# Altium project CustomPCB-test1.PrjPcb
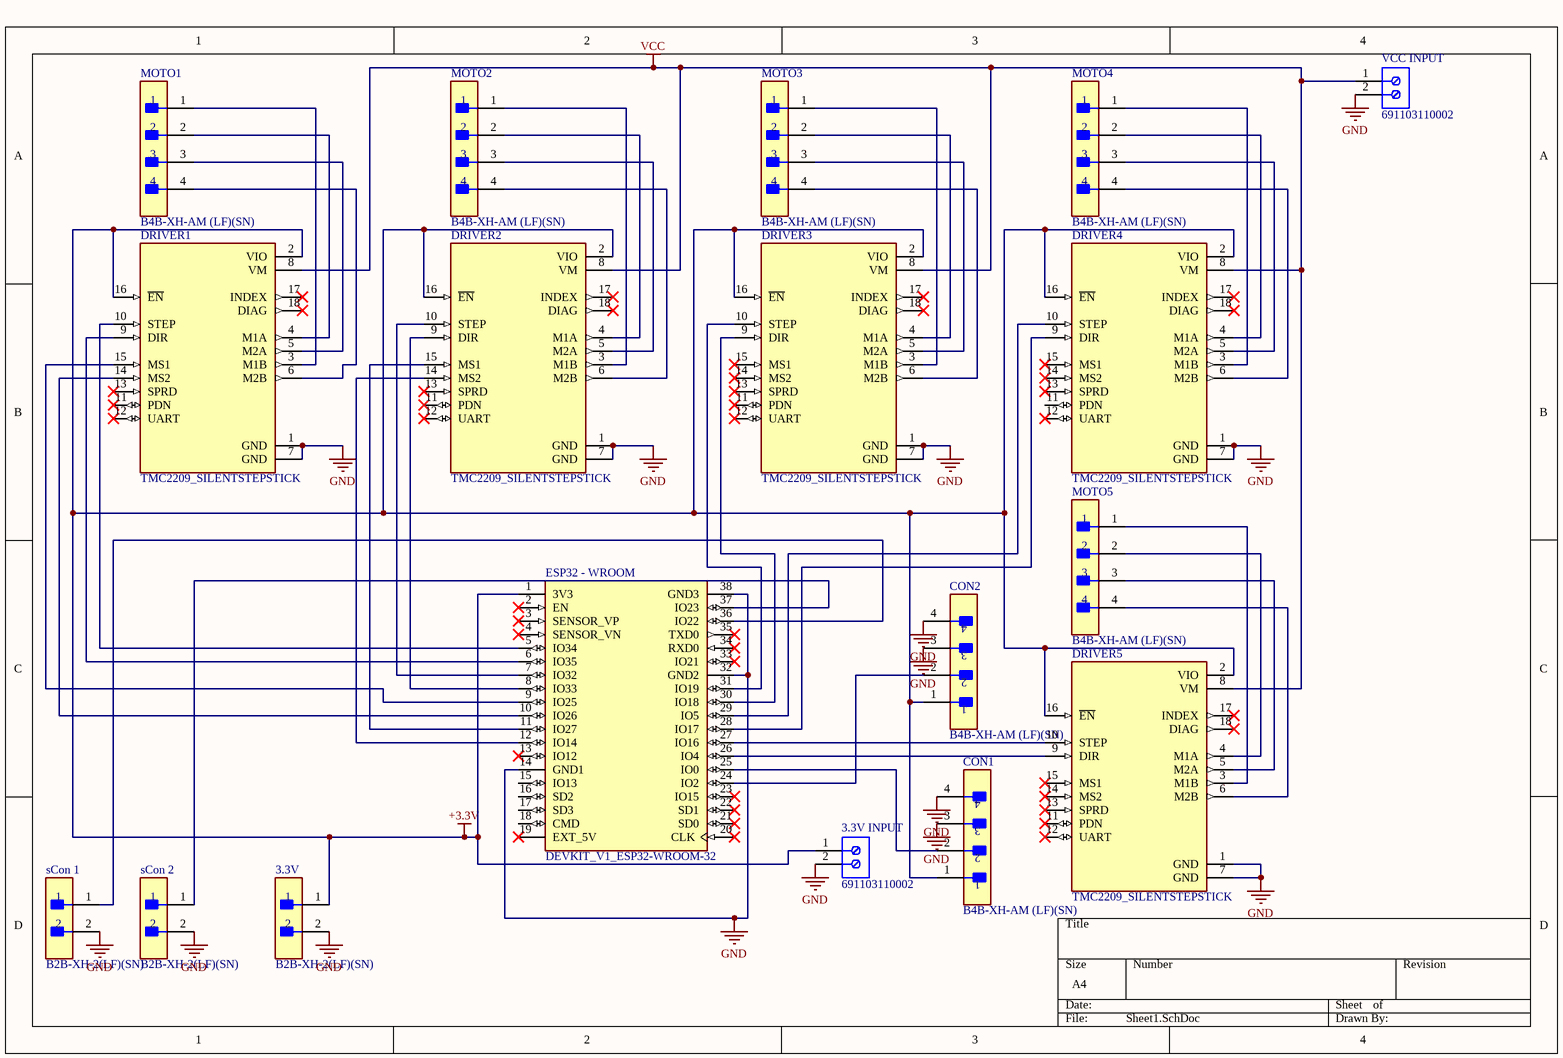
[diagram p0: Sheet1.SchDoc]
1 sheet, 18 parts. Net scope: global (net labels, ports and power ports of the same name join across sheets).
Board file: ESP32_DRIVER_BOARD.PcbDoc

## Sheet Sheet1.SchDoc
size A4; SheetNumber: 1; SheetTotal: 1

### Parts
3.3V  B2B-XH-2(LF)(SN)  [FP-B2B-XH-2_LF_SN-MFG]
3.3V_INPUT  691103110002  [691103110002]
CON1  B4B-XH-AM (LF)(SN)  [FP-B4B-XH-AM_LF_SN-MFG]
CON2  B4B-XH-AM (LF)(SN)  [FP-B4B-XH-AM_LF_SN-MFG]
DRIVER1  TMC2209_SILENTSTEPSTICK  [MODULE_TMC2209_SILENTSTEPSTICK]
DRIVER2  TMC2209_SILENTSTEPSTICK  [MODULE_TMC2209_SILENTSTEPSTICK]
DRIVER3  TMC2209_SILENTSTEPSTICK  [MODULE_TMC2209_SILENTSTEPSTICK]
DRIVER4  TMC2209_SILENTSTEPSTICK  [MODULE_TMC2209_SILENTSTEPSTICK]
DRIVER5  TMC2209_SILENTSTEPSTICK  [MODULE_TMC2209_SILENTSTEPSTICK]
ESP32_-_WROOM  DEVKIT_V1_ESP32-WROOM-32  [MODULE_DEVKIT_V1_ESP32-WROOM-32]
MOTO1  B4B-XH-AM (LF)(SN)  [FP-B4B-XH-AM_LF_SN-MFG]
MOTO2  B4B-XH-AM (LF)(SN)  [FP-B4B-XH-AM_LF_SN-MFG]
MOTO3  B4B-XH-AM (LF)(SN)  [FP-B4B-XH-AM_LF_SN-MFG]
MOTO4  B4B-XH-AM (LF)(SN)  [FP-B4B-XH-AM_LF_SN-MFG]
MOTO5  B4B-XH-AM (LF)(SN)  [FP-B4B-XH-AM_LF_SN-MFG]
sCon_1  B2B-XH-2(LF)(SN)  [FP-B2B-XH-2_LF_SN-MFG]
sCon_2  B2B-XH-2(LF)(SN)  [FP-B2B-XH-2_LF_SN-MFG]
VCC_INPUT  691103110002  [691103110002]

### Nets
+3.3V: 3.3V.1 3.3V_INPUT.1 CON1.1 CON2.1 DRIVER1.2(VIO) DRIVER1.16(~{EN}) DRIVER2.2(VIO) DRIVER2.16(~{EN}) DRIVER3.2(VIO) DRIVER3.16(~{EN}) DRIVER4.2(VIO) DRIVER4.16(~{EN}) DRIVER5.2(VIO) DRIVER5.16(~{EN}) ESP32_-_WROOM.1(3V3)
GND: 3.3V.2 3.3V_INPUT.2 CON1.3 CON1.4 CON2.3 CON2.4 DRIVER1.1(GND) DRIVER1.7(GND) DRIVER2.1(GND) DRIVER2.7(GND) DRIVER3.1(GND) DRIVER3.7(GND) DRIVER4.1(GND) DRIVER4.7(GND) DRIVER5.1(GND) DRIVER5.7(GND) ESP32_-_WROOM.14(GND1) ESP32_-_WROOM.32(GND2) ESP32_-_WROOM.38(GND3) sCon_1.2 sCon_2.2 VCC_INPUT.2
VCC: DRIVER1.8(VM) DRIVER2.8(VM) DRIVER3.8(VM) DRIVER4.8(VM) DRIVER5.8(VM) VCC_INPUT.1
NetCON1_2: CON1.2 ESP32_-_WROOM.25(IO0)
NetCON2_2: CON2.2 ESP32_-_WROOM.24(IO2)
NetDRIVER1_3: DRIVER1.3(M1B) MOTO1.1
NetDRIVER1_4: DRIVER1.4(M1A) MOTO1.2
NetDRIVER1_5: DRIVER1.5(M2A) MOTO1.3
NetDRIVER1_6: DRIVER1.6(M2B) MOTO1.4
NetDRIVER1_9: DRIVER1.9(DIR) ESP32_-_WROOM.6(IO35)
NetDRIVER1_10: DRIVER1.10(STEP) ESP32_-_WROOM.5(IO34)
NetDRIVER1_14: DRIVER1.14(MS2) ESP32_-_WROOM.10(IO26)
NetDRIVER1_15: DRIVER1.15(MS1) ESP32_-_WROOM.9(IO25)
NetDRIVER2_3: DRIVER2.3(M1B) MOTO2.1
NetDRIVER2_4: DRIVER2.4(M1A) MOTO2.2
NetDRIVER2_5: DRIVER2.5(M2A) MOTO2.3
NetDRIVER2_6: DRIVER2.6(M2B) MOTO2.4
NetDRIVER2_9: DRIVER2.9(DIR) ESP32_-_WROOM.8(IO33)
NetDRIVER2_10: DRIVER2.10(STEP) ESP32_-_WROOM.7(IO32)
NetDRIVER2_14: DRIVER2.14(MS2) ESP32_-_WROOM.12(IO14)
NetDRIVER2_15: DRIVER2.15(MS1) ESP32_-_WROOM.11(IO27)
NetDRIVER3_3: DRIVER3.3(M1B) MOTO3.1
NetDRIVER3_4: DRIVER3.4(M1A) MOTO3.2
NetDRIVER3_5: DRIVER3.5(M2A) MOTO3.3
NetDRIVER3_6: DRIVER3.6(M2B) MOTO3.4
NetDRIVER3_9: DRIVER3.9(DIR) ESP32_-_WROOM.30(IO18)
NetDRIVER3_10: DRIVER3.10(STEP) ESP32_-_WROOM.31(IO19)
NetDRIVER4_3: DRIVER4.3(M1B) MOTO4.1
NetDRIVER4_4: DRIVER4.4(M1A) MOTO4.2
NetDRIVER4_5: DRIVER4.5(M2A) MOTO4.3
NetDRIVER4_6: DRIVER4.6(M2B) MOTO4.4
NetDRIVER4_9: DRIVER4.9(DIR) ESP32_-_WROOM.28(IO17)
NetDRIVER4_10: DRIVER4.10(STEP) ESP32_-_WROOM.29(IO5)
NetDRIVER5_3: DRIVER5.3(M1B) MOTO5.1
NetDRIVER5_4: DRIVER5.4(M1A) MOTO5.2
NetDRIVER5_5: DRIVER5.5(M2A) MOTO5.3
NetDRIVER5_6: DRIVER5.6(M2B) MOTO5.4
NetDRIVER5_9: DRIVER5.9(DIR) ESP32_-_WROOM.26(IO4)
NetDRIVER5_10: DRIVER5.10(STEP) ESP32_-_WROOM.27(IO16)
NetESP32_-_WROOM_36: ESP32_-_WROOM.36(IO22) sCon_1.1
NetESP32_-_WROOM_37: ESP32_-_WROOM.37(IO23) sCon_2.1

Not connected (* = marked no-connect by the designer): DRIVER1 11(PDN)* 12(UART)* 13(SPRD)* 17(INDEX)* 18(DIAG)*; DRIVER2 11(PDN)* 12(UART)* 13(SPRD)* 17(INDEX)* 18(DIAG)*; DRIVER3 11(PDN)* 12(UART)* 13(SPRD)* 14(MS2)* 15(MS1)* 17(INDEX)* 18(DIAG)*; DRIVER4 11(PDN) 12(UART)* 13(SPRD)* 14(MS2)* 15(MS1)* 17(INDEX)* 18(DIAG)*; DRIVER5 11(PDN)* 12(UART)* 13(SPRD)* 14(MS2)* 15(MS1)* 17(INDEX)* 18(DIAG)*; ESP32_-_WROOM 2(EN)* 3(SENSOR_VP)* 4(SENSOR_VN)* 13(IO12)* 15(IO13) 16(SD2) 17(SD3) 18(CMD) 19(EXT_5V)* 20(CLK)* 21(SD0)* 22(SD1)* 23(IO15)* 33(IO21)* 34(RXD0)* 35(TXD0)*

### Library data of the parts
3.3V sCon_1 sCon_2 = CMP-17439-000499-1: CONN HEADER VERT 2POS 2.5MM; Shape: Straight; Number of Positions: 2; Voltage Rating: 250V; Current Rating: 3A; Termination: Press-Fit; Contact Shape: Square; Width: 5.75mm; Fastening Type: Detent; Flammability Rating: UL94 V-0; Insulation Color: Natural; Housing Material: Nylon; Contact Type: Male Pin; Height: 7mm; Number of Rows: 1; Connector Type: Header; Mount: Through Hole; Contact Material: Brass; Series: XH; Max Operating Temperature: 85°C; Insulation Material: Nylon; Length: 7.4mm; Pitch: 2.5mm; Packaging: Bulk; Number of Poles: 2; Contact Finish - Mating: TIN; Min Operating Temperature: -25°C
3.3V_INPUT VCC_INPUT = CMP-1502-03254-2: NexarPartId: 18818286; Pitch: 3.5052mm; Current Rating: 10A; Number of Positions Per Level: 2; Plating: Steel; Number of Levels: 1; Voltage: 125V; Wire/Cable Gauge: 26AWG; Stripping Length: -6mm; Wire Gauge (Min): 16AWG; Packaging: Box; Number of Rows: 1; Color: Blue; Height: 8.5mm; Current: 10A; Lead Pitch: 3.5mm; RoHS: Compliant; Housing Material: Nylon; Width: 8mm; Length: 7mm; Contact Plating: Tin; Number of Pins: 2; Mount: Through Hole; Min Operating Temperature: -40°C; Number of Contacts: 2; REACH SVHC: Unknown; Termination: Screw; Wire Gauge (Max): 26AWG; Max Operating Temperature: 105°C; Voltage Rating: 125V; Contact Material: Brass, Copper, Nickel, Tin, Zinc
CON1 CON2 MOTO1-MOTO5 = CMP-17439-000117-1: CONN HEADER VERT 4POS 2.5MM; Max Current Rating: 3A; Gender: Male; Contact Resistance: 20mR; Number of Positions: 4; Mated Stacking Heights: 9.8mm; Voltage Rating: 250V; Length: 12.4mm; Orientation: Straight; Pitch: 2.5mm; Housing Material: Polyamide; Max Operating Temperature: 85°C; Fastening Type: Detent; Housing Color: White; Series: XH; Packaging: Bulk; Number of Rows: 1; Insulation Material: Nylon; Contact Plating: Copper; Contact Type: Male Pin; Connector Type: Header; Color: Green; Insulation Color: Natural; Contact Finish - Mating: TIN; Lead Free: Lead Free; Termination: Solder; Depth: 5.75mm; Number of Pins: 4; Contact Material: Brass; Mount: Through Hole; Max Voltage Rating (AC): 250V; Flammability Rating: UL94 V-0; Min Operating Temperature: -25°C; Contact Shape: Square
DRIVER1-DRIVER5 = TMC2209_SILENTSTEPSTICK: TMC2209 Motor Controller/Driver Power Management Evaluation Board; MP: TMC2209 SILENTSTEPSTICK; MF: Trinamic Motion Control GmbH; Check_prices: https://www.snapeda.com/parts/TMC2209%20SILENTSTEPSTICK/Trinamic+Motion+Control+GmbH/view-part/?ref=eda; Price: None; SnapEDA_Link: https://www.snapeda.com/parts/TMC2209%20SILENTSTEPSTICK/Trinamic+Motion+Control+GmbH/view-part/?ref=snap; Availability: In Stock; Value: *; Purchase-URL: https://pricing.snapeda.com/search/part/TMC2209 SILENTSTEPSTICK/?ref=eda; Package: None
ESP32_-_WROOM = DEVKIT_V1_ESP32-WROOM-32: WROOM-32 Development Board ESP32 ESP-32S WiFi Bluetooth Dev Module; MF: Espressif Systems; MP: DEVKIT V1 ESP32-WROOM-32; SnapEDA_Link: https://www.snapeda.com/parts/DEVKIT%20V1%20ESP32-WROOM-32/Espressif+Systems/view-part/?ref=snap; Package: Package; Value: *; Check_prices: https://www.snapeda.com/parts/DEVKIT%20V1%20ESP32-WROOM-32/Espressif+Systems/view-part/?ref=eda